# Altium schematic sheet Leds Indicadores.SchDoc
size A4
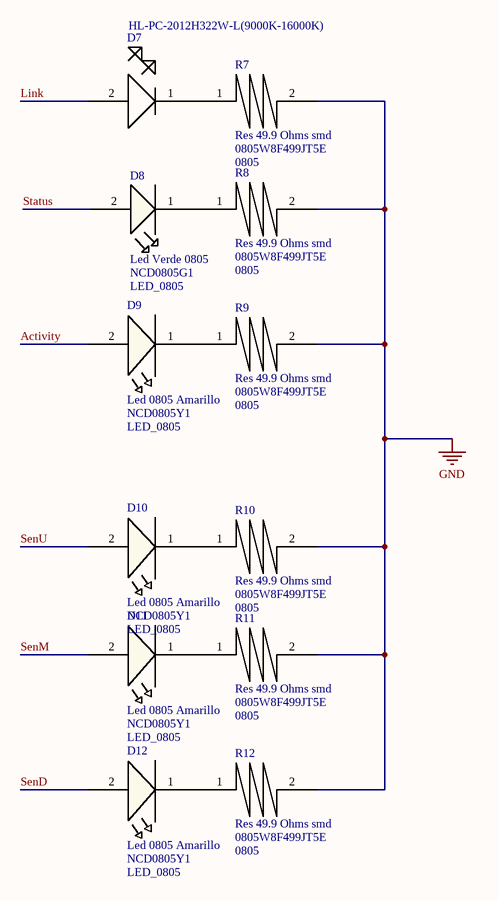
[diagram p0: Leds Indicadores.SchDoc]

## Parts
D7  HL-PC-2012H322W-L(9000K-16000K)  [Led 0805 White]
D8  Led Verde 0805  MFR.Part #: NCD0805G1  Package: LED_0805  [Led 0805 Verde]
D9  Led 0805 Amarillo  Package: LED_0805  [Led 0805 Amarillo]
D10  Led 0805 Amarillo  Package: LED_0805  [Led 0805 Amarillo]
D11  Led 0805 Amarillo  Package: LED_0805  [Led 0805 Amarillo]
D12  Led 0805 Amarillo  Package: LED_0805  [Led 0805 Amarillo]
R7  Res 49.9 Ohms smd  MFR.Part #: 0805W8F499JT5E  Package: 0805  [RES 49.9 OHMS]
R8  Res 49.9 Ohms smd  MFR.Part #: 0805W8F499JT5E  Package: 0805  [RES 49.9 OHMS]
R9  Res 49.9 Ohms smd  MFR.Part #: 0805W8F499JT5E  Package: 0805  [RES 49.9 OHMS]
R10  Res 49.9 Ohms smd  MFR.Part #: 0805W8F499JT5E  Package: 0805  [RES 49.9 OHMS]
R11  Res 49.9 Ohms smd  MFR.Part #: 0805W8F499JT5E  Package: 0805  [RES 49.9 OHMS]
R12  Res 49.9 Ohms smd  MFR.Part #: 0805W8F499JT5E  Package: 0805  [RES 49.9 OHMS]

## Nets
GND: R7.2 R8.2 R9.2 R10.2 R11.2 R12.2
Activity: D9.2
Link: D7.2
SenD: D12.2
SenM: D11.2
SenU: D10.2
Status: D8.2
NetD7_1: D7.1 R7.1
NetD8_1: D8.1 R8.1
NetD9_1: D9.1 R9.1
NetD10_1: D10.1 R10.1
NetD11_1: D11.1 R11.1
NetD12_1: D12.1 R12.1

## Library data of the parts
D7 = LED White 0805: MFR.Part #: HL-PC-2012H322W-L(9000K-16000K); Package: LED0805-RD
D8 = Led 0805 Verde
D9-D12 = Led 0805 Amarillo: NCD0805Y1; MFR.Part #: NCD0805Y1